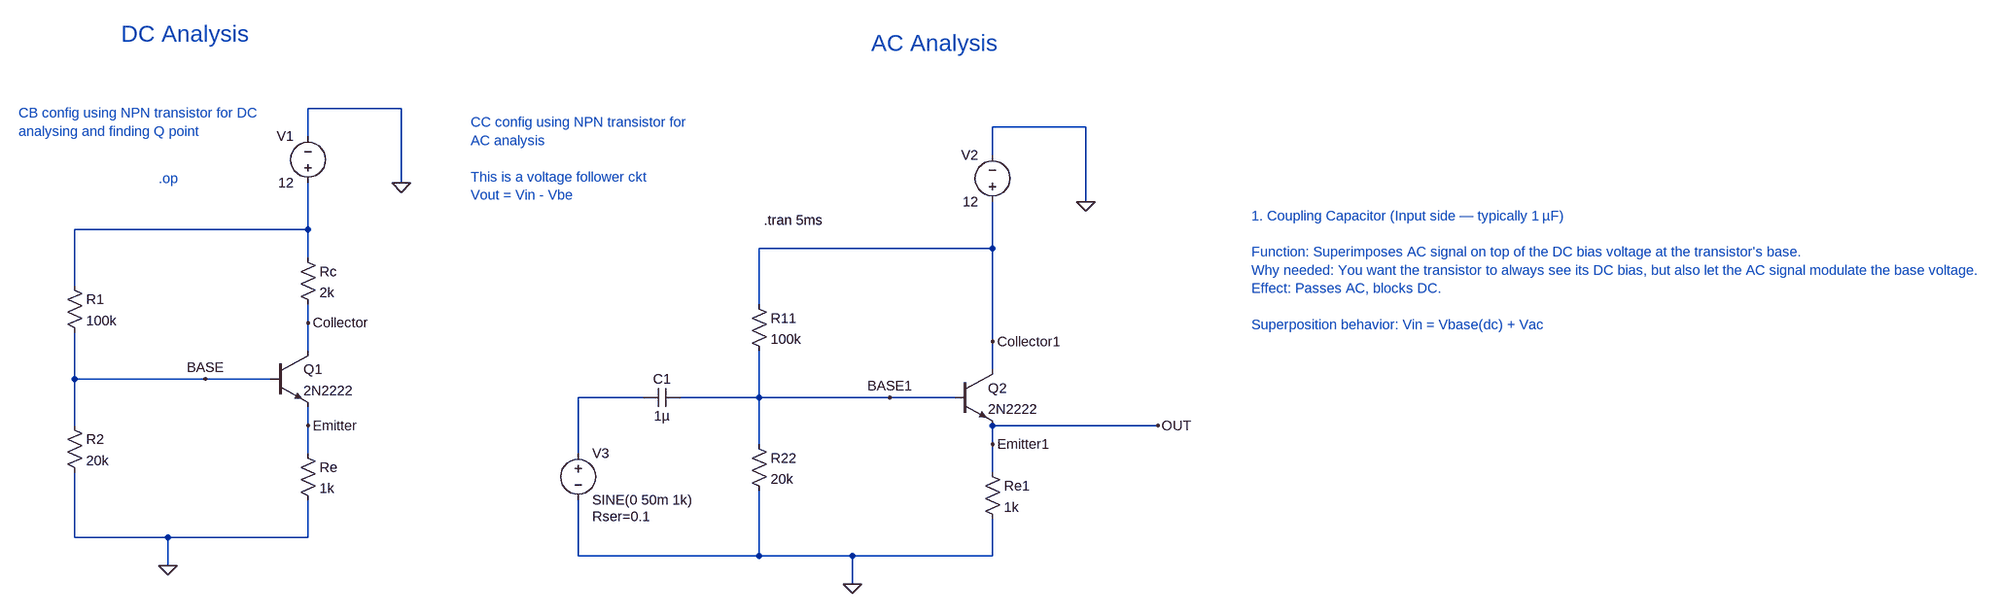
[diagram p0: schematic CC_config_DC_AC_analysis.asc]
CC_config_DC_AC_analysis.asc, the LTspice schematic file:
Version 4.1
SHEET 1 4048 724
WIRE -320 -368 -480 -368
WIRE 1360 -336 1200 -336
WIRE -480 -320 -480 -368
WIRE 1200 -288 1200 -336
WIRE -320 -240 -320 -368
WIRE 1360 -208 1360 -336
WIRE -480 -160 -480 -240
WIRE -480 -160 -880 -160
WIRE 1200 -128 1200 -208
WIRE 1200 -128 800 -128
WIRE -480 -112 -480 -160
WIRE -880 -64 -880 -160
WIRE 800 -32 800 -128
WIRE -480 0 -480 -32
WIRE 1200 32 1200 -128
WIRE -480 48 -480 0
WIRE 1200 80 1200 32
WIRE -880 96 -880 16
WIRE -656 96 -880 96
WIRE -544 96 -656 96
WIRE 560 128 448 128
WIRE 800 128 800 48
WIRE 800 128 624 128
WIRE 1024 128 800 128
WIRE 1136 128 1024 128
WIRE -880 176 -880 96
WIRE -480 176 -480 144
WIRE 1552 176 1200 176
WIRE 800 208 800 128
WIRE 1200 208 1200 176
WIRE -480 224 -480 176
WIRE 448 224 448 128
WIRE 1200 256 1200 208
WIRE -880 368 -880 256
WIRE -720 368 -880 368
WIRE -480 368 -480 304
WIRE -480 368 -720 368
WIRE 448 400 448 304
WIRE 800 400 800 288
WIRE 800 400 448 400
WIRE 960 400 800 400
WIRE 1200 400 1200 336
WIRE 1200 400 960 400
WIRE -720 416 -720 368
WIRE 960 448 960 400
FLAG -320 -240 0
FLAG -720 416 0
FLAG -480 0 Collector
FLAG -480 176 Emitter
FLAG -656 96 BASE
FLAG 1360 -208 0
FLAG 960 448 0
FLAG 1200 32 Collector1
FLAG 1200 208 Emitter1
FLAG 1024 128 BASE1
FLAG 1552 176 OUT
SYMBOL npn -544 48 R0
SYMATTR InstName Q1
SYMATTR Value 2N2222
SYMBOL voltage -480 -224 R180
WINDOW 0 24 96 Left 2
WINDOW 3 24 16 Left 2
WINDOW 123 0 0 Left 0
WINDOW 39 0 0 Left 0
SYMATTR InstName V1
SYMATTR Value 12
SYMBOL res -496 -128 R0
SYMATTR InstName Rc
SYMATTR Value 2k
SYMBOL res -496 208 R0
SYMATTR InstName Re
SYMATTR Value 1k
SYMBOL res -896 -80 R0
SYMATTR InstName R1
SYMATTR Value 100k
SYMBOL res -896 160 R0
SYMATTR InstName R2
SYMATTR Value 20k
SYMBOL npn 1136 80 R0
SYMATTR InstName Q2
SYMATTR Value 2N2222
SYMBOL voltage 1200 -192 R180
WINDOW 0 24 96 Left 2
WINDOW 3 24 16 Left 2
WINDOW 123 0 0 Left 0
WINDOW 39 0 0 Left 0
SYMATTR InstName V2
SYMATTR Value 12
SYMBOL res 1184 240 R0
SYMATTR InstName Re1
SYMATTR Value 1k
SYMBOL res 784 -48 R0
SYMATTR InstName R11
SYMATTR Value 100k
SYMBOL res 784 192 R0
SYMATTR InstName R22
SYMATTR Value 20k
SYMBOL voltage 448 208 R0
WINDOW 123 0 0 Left 0
WINDOW 39 24 124 Left 2
SYMATTR SpiceLine Rser=0.1
SYMATTR InstName V3
SYMATTR Value SINE(0 50m 1k)
SYMBOL cap 624 112 R90
WINDOW 0 0 32 VBottom 2
WINDOW 3 32 32 VTop 2
SYMATTR InstName C1
SYMATTR Value 1µ
TEXT -736 -248 Left 2 ;.op
TEXT -976 -360 Left 2 ;CB config using NPN transistor for DC \nanalysing and finding Q point
TEXT 264 -344 Left 2 ;CC config using NPN transistor for \nAC analysis\n \nThis is a voltage follower ckt\nVout = Vin - Vbe
TEXT 808 -176 Left 2 !.tran 5ms
TEXT 2696 -184 Left 2 ;1. Coupling Capacitor (Input side — typically 1 µF)\n \nFunction: Superimposes AC signal on top of the DC bias voltage at the transistor's base.\nWhy needed: You want the transistor to always see its DC bias, but also let the AC signal modulate the base voltage.\nEffect: Passes AC, blocks DC.\n \nSuperposition behavior: Vin = Vbase(dc) + Vac
TEXT -800 -496 Left 4 ;DC Analysis
TEXT 992 -480 Left 4 ;AC Analysis

The netlist it stands for:
* CC_config_DC_AC_analysis.asc
Q1 Collector BASE Emitter 0 2N2222
V1 N001 0 12
Rc N001 Collector 2k
Re Emitter 0 1k
R1 N001 BASE 100k
R2 BASE 0 20k
Q2 Collector1 BASE1 OUT 0 2N2222
V2 Collector1 0 12
Re1 OUT 0 1k
R11 Collector1 BASE1 100k
R22 BASE1 0 20k
V3 N002 0 SINE(0 50m 1k) Rser=0.1
C1 BASE1 N002 1µ
.model NPN NPN
.model PNP PNP
.lib standard.bjt
* .op
* CB config using NPN transistor for DC
* analysing and finding Q point
* CC config using NPN transistor for
* AC analysis
* This is a voltage follower ckt
* Vout = Vin - Vbe
.tran 5ms
* 1. Coupling Capacitor (Input side — typically 1 µF)
* Function: Superimposes AC signal on top of the DC bias voltage at the transistor's base.
* Why needed: You want the transistor to always see its DC bias, but also let the AC signal modulate the base voltage.
* Effect: Passes AC, blocks DC.
* Superposition behavior: Vin = Vbase(dc) + Vac
* DC Analysis
* AC Analysis
.backanno
.end